# Altium schematic sheet Top.SchDoc
size A4
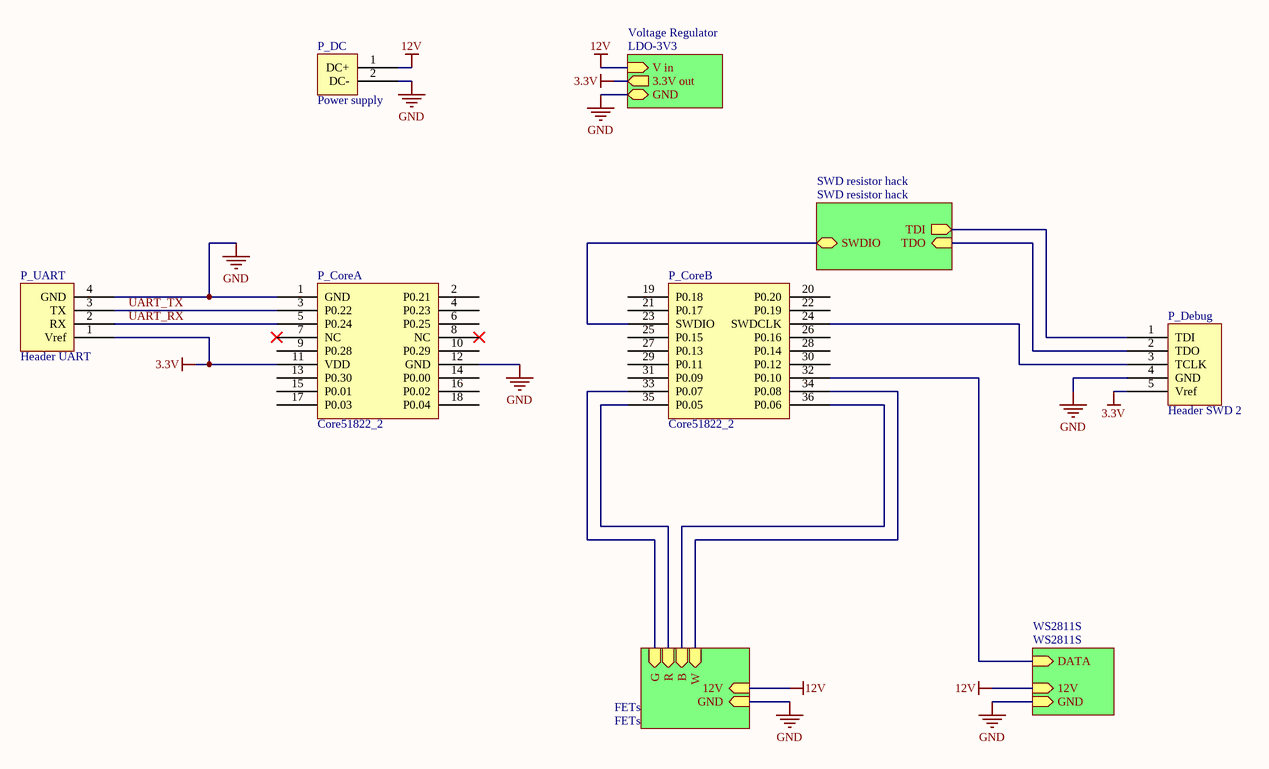
[diagram p0: Top.SchDoc]

## Parts
P_Core  Core51822_2  [Core51822]  (parts A,B of 2)
P_DC  Power supply  [DC cable pad with holes]
P_Debug  Header SWD 2  [Header 1x5 2.54mm]
P_UART  Header UART  [Header 1x4 2.54mm]

## Sub-sheets
FETs = FETs: 12V (in), GND (in), G (in), R (in), B (in), W (in)
SWD resistor hack = SWD resistor hack: SWDIO (bidir), TDI (out), TDO (in)
Voltage Regulator = LDO-3V3: 3.3V out (out), GND, V in (in)
WS2811S = WS2811S: DATA (in), 12V (in), GND (in)

## Nets
3.3V: P_Core.11(VDD) P_Debug.5(Vref) P_UART.1(Vref) ; sheet Voltage Regulator/3.3V out
12V: P_DC.1(DC+) ; sheet Voltage Regulator/V in, sheet FETs/12V, sheet WS2811S/12V
GND: P_Core.1(GND) P_Core.12(GND) P_DC.2(DC-) P_Debug.4(GND) P_UART.4(GND) ; sheet Voltage Regulator/GND, sheet FETs/GND, sheet WS2811S/GND
UART_RX: P_Core.5(P0.24) P_UART.2(RX)
UART_TX: P_Core.3(P0.22) P_UART.3(TX)
NetP_Core_23: P_Core.23(SWDIO) ; sheet SWD resistor hack/SWDIO
NetP_Core_24: P_Core.24(SWDCLK) P_Debug.3(TCLK)
NetP_Core_32: P_Core.32(P0.10) ; sheet WS2811S/DATA
NetP_Core_33: P_Core.33(P0.07) ; sheet FETs/G
NetP_Core_34: P_Core.34(P0.08) ; sheet FETs/W
NetP_Core_35: P_Core.35(P0.05) ; sheet FETs/R
NetP_Core_36: P_Core.36(P0.06) ; sheet FETs/B
NetP_Debug_1: P_Debug.1(TDI) ; sheet SWD resistor hack/TDI
NetP_Debug_2: P_Debug.2(TDO) ; sheet SWD resistor hack/TDO

Not connected (* = marked no-connect by the designer): P_Core 2(P0.21) 4(P0.23) 6(P0.25) 7(NC)* 8(NC)* 9(P0.28) 10(P0.29) 13(P0.30) 14(P0.00) 15(P0.01) 16(P0.02) 17(P0.03) 18(P0.04) 19(P0.18) 20(P0.20) 21(P0.17) 22(P0.19) 25(P0.15) 26(P0.16) 27(P0.13) 28(P0.14) 29(P0.11) 30(P0.12) 31(P0.09)